# Altium project ESE292-2017F_StudentMCUBoard.PrjPcb
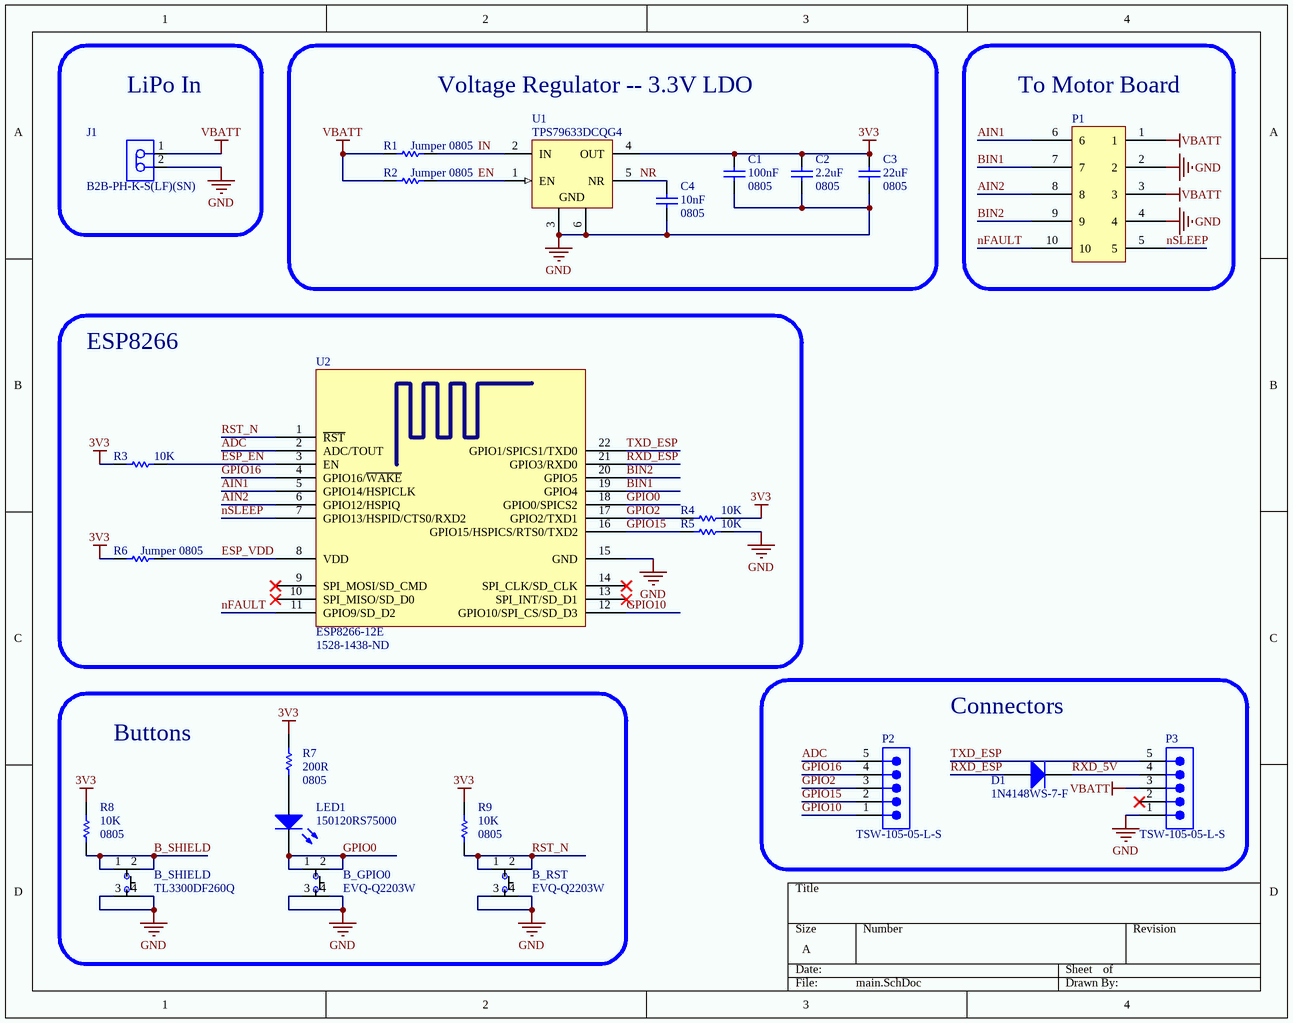
[diagram p0: main.SchDoc]
1 sheet, 24 parts. Net scope: global (net labels, ports and power ports of the same name join across sheets).
Board files: NickPCB_Example.PcbDoc, ffan_pcb.PcbDoc

## Sheet main.SchDoc: ESE292-2017F Student MCU Board
size A; DocumentName: ESE292-2017F Student MCU Board

### Parts
B_GPIO0  EVQ-Q2203W  [EVQ-Q2203W]
B_RST  EVQ-Q2203W  [EVQ-Q2203W]
B_SHIELD  TL3300DF260Q  [TL3300DF260Q]
C1  100nF  Case-EIA: 0805  [CAPC0805(2012)100_N]
C2  2.2uF  Case-EIA: 0805  [CAPC0805(2012)145_L]
C3  22uF  Case-EIA: 0805  [CAPC0805(2012)145_L]
C4  10nF  Case-EIA: 0805  [CAPC0805(2012)145_M]
D1  1N4148WS-7-F  [DIOD-SOD323-2-A_V]
J1  B2B-PH-K-S(LF)(SN)  [JST-B2B-PH-K-S_V]
LED1  150120RS75000  [1206_A]
P1  302-S101  [302-S101]  (value not drawn)
P2  TSW-105-05-L-S  [SMTC-TSW-105-05-X-S]
P3  TSW-105-05-L-S  [SMTC-TSW-105-05-X-S]
R1  Jumper 0805  [RESC0805(2012)_N]
R2  Jumper 0805  [RESC0805(2012)_N]
R3  10K  [RESC0805(2012)_L]
R4  10K  [RESC0805(2012)_L]
R5  10K  [RESC0805(2012)_L]
R6  Jumper 0805  [RESC0805(2012)_N]
R7  200R  Case-EIA: 0805  [RESC0805(2012)_M]
R8  10K  Case-EIA: 0805  [RESC0805(2012)_L]
R9  10K  Case-EIA: 0805  [RESC0805(2012)_L]
U1  TPS79633DCQG4  [DCQ0006A_N]
U2  ESP8266-12E  Supplier Part Number 1: 1528-1438-ND  [ESP8266-12E]

### Blocks framed on the sheet
LiPo In: J1
Voltage Regulator -- 3.3V LDO: C1-C4 R1 R2 U1
To Motor Board: P1
ESP8266: R3-R6 U2
Buttons: B_GPIO0 B_RST B_SHIELD LED1 R7-R9
Connectors: D1 P2 P3

### Nets
3V3: C1.2 C2.2 C3.2 R3.1 R4.2 R6.2 R7.2 R8.2 R9.2 U1.4(OUT)
GND: B_GPIO0.3 B_GPIO0.4 B_RST.3 B_RST.4 B_SHIELD.3 B_SHIELD.4 C1.1 C2.1 C3.1 C4.2 J1.2 P1.2 P1.4 P3.1 R5.2 U1.3(GND) U1.6(GND) U2.15(GND)
VBATT: J1.1 P1.1 P1.3 P3.3 R1.2 R2.2
ADC: P2.5 U2.2(ADC/TOUT)
AIN1: P1.6 U2.5(GPIO14/HSPICLK)
AIN2: P1.8 U2.6(GPIO12/HSPIQ)
B_SHIELD: B_SHIELD.1 B_SHIELD.2 R8.1
BIN1: P1.7 U2.19(GPIO4)
BIN2: P1.9 U2.20(GPIO5)
EN: R2.1 U1.1(EN)
ESP_EN: R3.2 U2.3(EN)
ESP_VDD: R6.1 U2.8(VDD)
GPIO0: B_GPIO0.1 B_GPIO0.2 LED1.1(K) U2.18(GPIO0/SPICS2)
GPIO2: P2.3 R4.1 U2.17(GPIO2/TXD1)
GPIO10: P2.1 U2.12(GPIO10/SPI_CS/SD_D3)
GPIO15: P2.2 R5.1 U2.16(GPIO15/HSPICS/RTS0/TXD2)
GPIO16: P2.4 U2.4(GPIO16/~{WAKE})
IN: R1.1 U1.2(IN)
nFAULT: P1.10 U2.11(GPIO9/SD_D2)
NR: C4.1 U1.5(NR)
nSLEEP: P1.5 U2.7(GPIO13/HSPID/CTS0/RXD2)
RST_N: B_RST.1 B_RST.2 R9.1 U2.1(~{RST})
RXD_5V: D1.2(K) P3.4
RXD_ESP: D1.1(A) U2.21(GPIO3/RXD0)
TXD_ESP: P3.5 U2.22(GPIO1/SPICS1/TXD0)
NetLED1_2: LED1.2(A) R7.1

Not connected (* = marked no-connect by the designer): P3 2*; U2 9(SPI_MOSI/SD_CMD)* 10(SPI_MISO/SD_D0)* 13(SPI_INT/SD_D1)* 14(SPI_CLK/SD_CLK)*

### Library data of the parts
B_GPIO0 B_RST = EVQ-Q2203W: SWITCH TACTILE SPST-NO 0.02A 15V; Manufacturer: Panasonic Electronic Components; Switch Function: Off-Mom; Contact Rating @ Voltage: 0.02A @ 15VDC; Actuator Type: Standard; Actuator Height off PCB, Vertical: 3.10mm; Actuator Orientation: Top Actuated; Outline: 6.60mm x 6.00mm; Illumination: Non-Illuminated; Operating Force: 350gf; Switch Travel: 0.25mm; Mechanical Life: 100,000 Cycles; Supplier 1: Digi-Key; Manufacturer Part Number: EVQ-Q2203W; RoHS: RoHS Compliant; Category: Switches; Stock 1: 15024; Pricing 1: 1=0.3, 10=0.287, 25=0.2772, 50=0.2674, 100=0.2525, 250=0.2376, 500=0.2277, 1000=0.17325 (USD); Packaging: Cut Tape (CT); Part Status: Active; Circuit: SPST-NO; Mounting Type: Surface Mount; Actuator Length, Right Angle: -; Termination Style: J Lead; Illumination Type, Color: -; Illumination Voltage (Nominal): -; Ingress Protection: -; Features: Grounding Pin; Actuator Material: -; Operating Temperature: -40°C ~ 85°C; ComponentLink1URL: https://industrial.panasonic.com/cdbs/www-data/pdf/ATK0000/ATK0000CE28.pdf; ComponentLink1Description: https://industrial.panasonic.com/cdbs/www-data/pdf/ATK0000/ATK0000CE28.pdf; Supplier Part Number 1: P12964SCT-ND
B_SHIELD = TL3300DF260Q: SWITCH TACTILE SPST-NO 0.05A 12V; Manufacturer: E-Switch; Mechanical Life: 100000Cycles; Operating Force: 260gf; Current Rating: 50mA; Illumination Type: Non-Illuminated; Throw Configuration: SPST; Switch Travel: 0.35mm; Supplier 1: Digi-Key; Manufacturer Part Number: TL3300DF260Q; Stock 1: 7332; Pricing 1: 1=0.55, 10=0.529, 25=0.5188, 50=0.4992, 100=0.4308, 250=0.3916 (USD); Case/Package: SMD/SMT; Contact Plating: Silver; Min Operating Temperature: -25°C; Max Operating Temperature: 70°C; Package Quantity: 1; Packaging: Tape and Reel; Voltage Rating (DC): 12V; Termination: Gull Wing; Lead Free: Lead Free; ComponentLink1URL: https://datasheet.ciiva.com/2901/n301104-2901040.pdf; ComponentLink1Description: https://datasheet.ciiva.com/2901/n301104-2901040.pdf; Supplier Part Number 1: EG4907CT-ND
C1 = CMP-1036-04396-1: CAP 100nF 10V ±20% 0805 (2012 Metric) Thickness 1mm SMD; Tolerance: Â±20%; Case-Metric: 2012; Rated Voltage: 10 V; Value: 100nF; Technology: SMT; Max Thickness: 1 mm
C2 = CMP-1036-04826-1: CAP 2.2uF 10V ±20% 0805 (2012 Metric) Thickness 1.45mm SMD; Case-Metric: 2012; Tolerance: Â±20%; Max Thickness: 1.45 mm; Rated Voltage: 10 V; Value: 2.2uF; Technology: SMT
C3 = CMP-1036-04942-1: CAP 22uF 10V ±10% 0805 (2012 Metric) Thickness 1.45mm SMD; Case-Metric: 2012; Tolerance: Â±10%; Rated Voltage: 10 V; Max Thickness: 1.45 mm; Value: 22uF; Technology: SMT
C4 = CMP-1036-03808-1: CAP 10nF 10V ±10% 0805 (2012 Metric) Thickness 1.45mm SMD; Case-Metric: 2012; Tolerance: Â±10%; Technology: SMT; Max Thickness: 1.45 mm; Value: 10nF; Rated Voltage: 10 V
D1 = CMP-1667-00004-1: Fast Switching Diode, 75 V, 0.3 A, -65 to 150 degC, 2-Pin SOD323, RoHS, Tape and Reel; DatasheetVersion: Rev. 25-2, 03/2016; PackageDescription: 2-Pin Small Outline Diode, Body 1.7 x 1.3 mm; ComponentLink2Description: Datasheet; ComponentLink1URL: http://www.diodes.com/; PackageReference: SOD323-2; ComponentLink2URL: http://www.diodes.com/datasheets/ds30097.pdf; ComponentLink1Description: Manufacturer URL
J1 = CMP-2000-05162-1: Male Header, Pitch 2 mm, 1 x 2 Position, Height 6 mm, Tail Length 3.4 mm, -25 to 85 degC, RoHS, Bulk; Manufacturer: JST; Pitch: 2mm; Style/Orientation: StraightHeader/Plug; No of Positions: 2; Datasheet Version: Nov-08; Datasheet URL: http://datasheet.octopart.com/B2B-PH-K-S%28LF%29%28SN%29-JST-datasheet-8324864.pdf; Manufacturer URL: http://www.jst.com/home2.html; Type: ShroudedHeader; Termination: Crimp
LED1 = CMP-1426-00013-1: SMD mono-color Chip LED, WL-SMCW, Red; Manufacturer: Wuerth Elektronik; Color: Red; ComponentLink2URL: http://katalog.we-online.com/led/datasheet/150120RS75000.pdf; ComponentLink2Description: Datasheet; ComponentLink1Description: Manufacturer URL; ComponentLink1URL: http://www.we-online.com; PartNumber: 150120RS75000; PackageReference: 1206_A
P1 = 302-S101: 10 Positions Header, Shrouded Connector 0.100" (2.54mm) Through Hole Gold; Manufacturer: On-Shore Technology; Number of Positions: 10; Connector Type: Male Pin; Pitch: 0.1inch; Supplier 1: Digi-Key; Manufacturer Part Number: 302-S101; Stock 1: 89519; Pricing 1: 1=0.28, 10=0.263, 100=0.1838, 500=0.1575, 1000=0.1313, 5000=0.1125, 10000=0.105 (USD); Mount: Through Hole; Case/Package: 100; Colour: Black; Contact Plating: Gold; Number of Rows: 2; Packaging: Tray; Termination: Solder; Row Spacing: 0.1inch; ComponentLink1URL: https://datasheet.ciiva.com/732/302-sxxx-732946.pdf; ComponentLink1Description: https://datasheet.ciiva.com/732/302-sxxx-732946.pdf; Supplier Part Number 1: ED1543-ND
P2 P3 = CMP-1024-00366-1: Manufacturer: Samtec; Pitch: 2.54 mm; PackageVersion: DM, 8/1988; PartNumber: TSW-105-05-L-S; Orientation: Vertical; Temperature Range: -55 to 125 degC; ComponentLink1Description: Manufacturer URL; PackageDescription: .025[0.64] SQ. Post Terminal Strip Assembly; ComponentLink2URL: http://www.samtec.com/documents/webfiles/pdf/TSW_TH.PDF; PackageReference: TSW-105-05-X-S; ComponentLink2Description: Datasheet; Mounting Technology: Through-hole; DatasheetVersion: F-214; ComponentLink1URL: http://www.samtec.com; RoHS: True; ComponentLink3URL: http://www.samtec.com/documents/webfiles/cpdf/TSW-XXX-XX-XXX-X-XX-XXX-MKT.pdf; ComponentLink3Description: Package Specification
R1 R2 R6 = CMP-1013-00001-1: Jumper 0805 (2012 Metric); Case-EIA: 0805; Value: 0.00 Ohm; Tolerance: None; Case-Metric: 2012; Technology: SMT; Power: None
R3-R5 = CMP-1013-00098-1: 10K 0.125W 5% 0805 (2012 Metric)  SMD; Case-EIA: 0805; Case-Metric: 2012; Value: 10000.00 Ohm; Power: 0.125 W; Technology: SMT; Tolerance: 5 %
R7 = CMP-1013-00057-1: 200R 0.125W 5% 0805 (2012 Metric)  SMD; Value: 200.00 Ohm; Case-Metric: 2012; Tolerance: 5 %; Technology: SMT; Power: 0.125 W
R8 R9 = CMP-1013-00098-1: 10K 0.125W 5% 0805 (2012 Metric)  SMD; Case-Metric: 2012; Value: 10000.00 Ohm; Power: 0.125 W; Technology: SMT; Tolerance: 5 %
U1 = CMP-0395-00338-2: Single Output High PSRR LDO, 1 A, Fixed 3.3 V Output, 2.7 to 5.5 V Input, 6-pin SOT-223 (DCQ), -40 to 125 degC; Manufacturer: Texas Instruments; Iq(Typ)(mA): 0.26; Vin(Max)(V): 5.5; Vout Adj(Max)(V): 3.3; Accuracy(%): 2; SubFamily: Single Channel LDO; Vdo(Typ)(mV): 220; Iout(Max)(A): 1; Vin(Min)(V): 2.7; ComponentLink3Description: Package Specification; Mounting Technology: Surface Mount; ComponentLink2URL: http://www.ti.com/general/docs/lit/getliterature.tsp?genericPartNumber=TPS79633&fileType=pdf; ComponentLink1URL: http://www.ti.com/; Fixed Output Options(V): 3.3; ComponentLink3URL: http://www.ti.com/litv/pdf/mpds098c; Vout Adj(Min)(V): 3.3; ComponentLink2Description: Datasheet; DatasheetVersion: SLVS351N; PackageDescription: 6-Pin Plastic Small Outline, Body 3.5 x 6.5 mm, Pitch 1.27 mm; ComponentLink1Description: Manufacturer URL; PartNumber: TPS79633DCQG4; PackageReference: DCQ0006A; PackageVersion: 4202109/D
U2 = ESP8266-12E: Manufacturer: Adafruit Industries; Manufacturer Part Number: 2491; Frequency: 2.4GHz; Data Rate: 72.2Mbps; Sensitivity: -91dBm; Interface: I2C,SPI,UART; Current - Receiving: 56mA; Current - Transmitting: 170mA; Supplier 1: Digi-Key; Stock 1: 713; Pricing 1: 1=6.95, 10=6.255 (USD); Case/Package: Module; Min Operating Temperature: -40°C; Max Operating Temperature: 125°C; Packaging: Bulk